# Altium schematic sheet Auxiliary Power.SchDoc
size A4
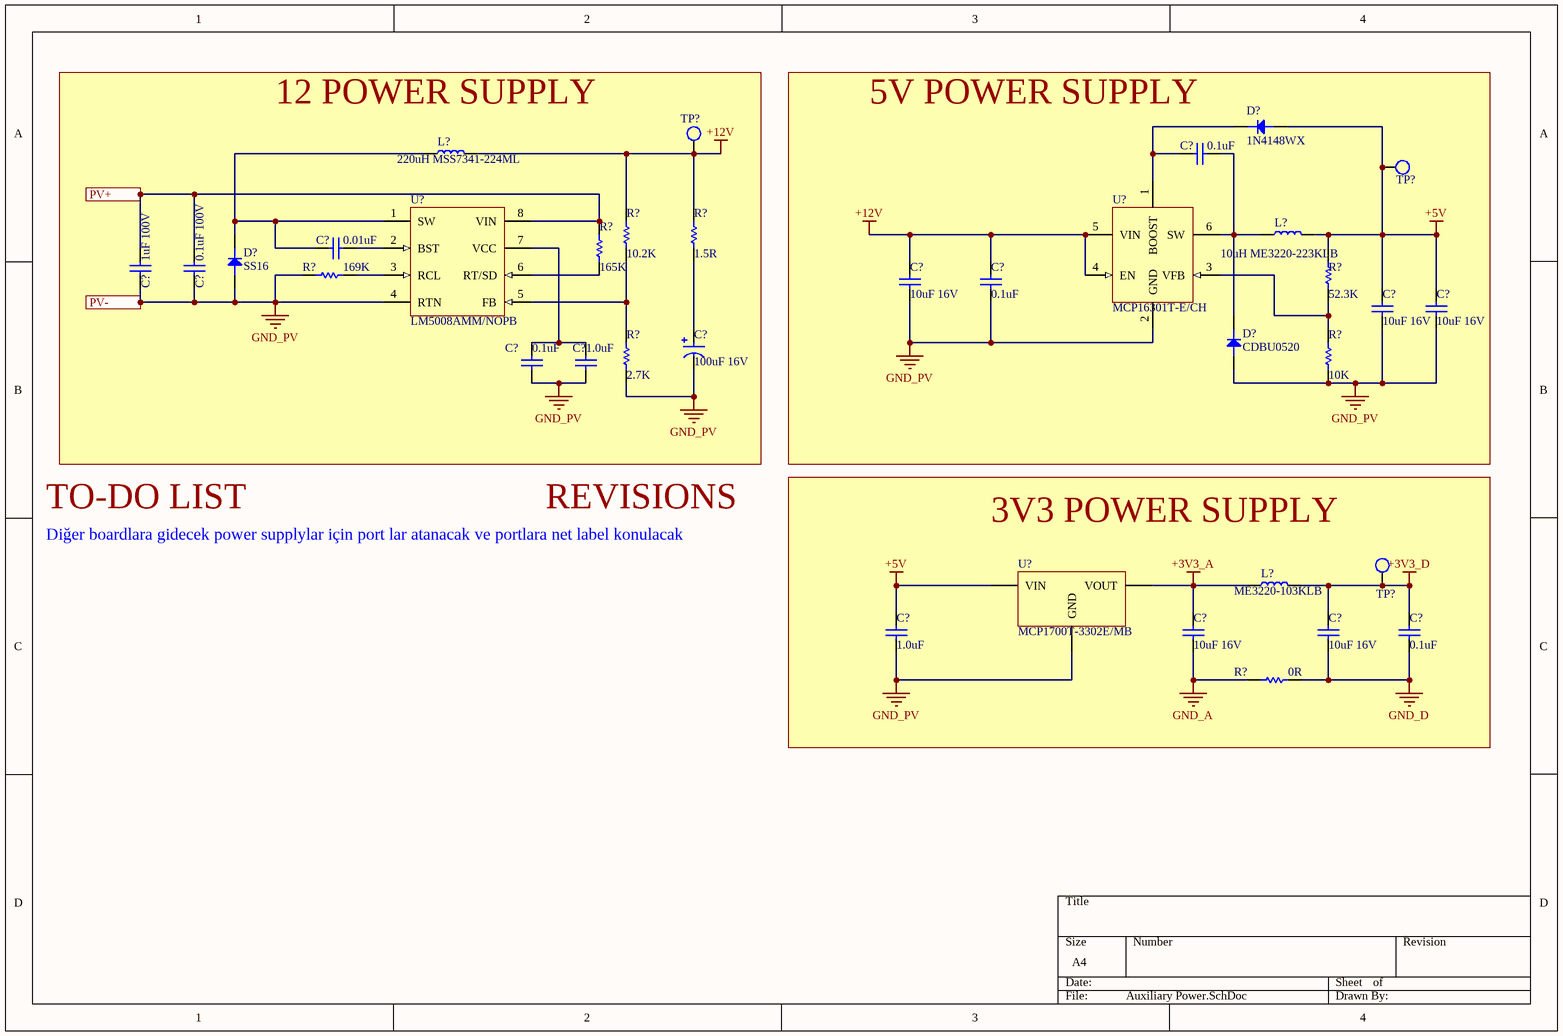
[diagram p0: Auxiliary Power.SchDoc]

## Parts
(Parts that share a designator on the sheet are numbered #1, #2 ... from top to bottom, then left to right.)
C?#1  0.1uF  [1206 CAPACITOR]
C?#2  0.01uF  [1206 CAPACITOR]
C?#3  1uF 100V  [1206 CAPACITOR]
C?#4  0.1uF 100V  [1206 CAPACITOR]
C?#5  10uF 16V  [1206 CAPACITOR]
C?#6  0.1uF  [1206 CAPACITOR]
C?#7  10uF 16V  [1206 CAPACITOR]
C?#8  10uF 16V  [1206 CAPACITOR]
C?#9  100uF 16V  [1206 CAPACITOR]
C?#10  0.1uF  [1206 CAPACITOR]
C?#11  1.0uF  [1206 CAPACITOR]
C?#12  1.0uF  [1206 CAPACITOR]
C?#13  10uF 16V  [1206 CAPACITOR]
C?#14  10uF 16V  [1206 CAPACITOR]
C?#15  0.1uF  [1206 CAPACITOR]
D?#1  1N4148WX  [SOD-323]
D?#2  SS16  [DO-214AC-SMA]
D?#3  CDBU0520  [SOT-523F]
L?#1  220uH MSS7341-224ML  [Inductor MSS7341-224ML]
L?#2  10uH ME3220-223KLB  [Inductor MEE3220-223KLB]
L?#3  ME3220-103KLB  [Inductor MEE3220-223KLB]
R?#1  10.2K  [1206 Resistor Footprint]
R?#2  1.5R  [1206 Resistor Footprint]
R?#3  165K  [1206 Resistor Footprint]
R?#4  169K  [1206 Resistor Footprint]
R?#5  52.3K  [1206 Resistor Footprint]
R?#6  2.7K  [1206 Resistor Footprint]
R?#7  10K  [1206 Resistor Footprint]
R?#8  0R  [1206 Resistor Footprint]
TP?#1  Test Point  [Test Point]  (value not drawn)
TP?#2  Test Point  [Test Point]  (value not drawn)
TP?#3  Test Point  [Test Point]  (value not drawn)
U?#1  LM5008AMM/NOPB  [TSOP 8-LEADS]
U?#2  MCP16301T-E/CH  [SOT-23-6]
U?#3  MCP1700T-3302E/MB  [SOT23-3]

## Blocks framed on the sheet
12 POWER SUPPLY: C?#2-C?#4 C?#9-C?#11 D?#2 L?#1 R?#1-R?#4 R?#6 TP?#1 U?#1
5V POWER SUPPLY: C?#1 C?#5-C?#8 D?#1 D?#3 L?#2 R?#5 R?#7 TP?#2 U?#2
3V3 POWER SUPPLY: C?#12-C?#15 L?#3 R?#8 TP?#3 U?#3

## Ports
PV+, PV-

## Nets
+3V3_A: C?#13.2 L?#3.1 U?#3.3(VOUT)
+3V3_D: C?#14.2 C?#15.2 L?#3.2 TP?#3.1
+5V: C?#7.2 C?#8.2 C?#12.2 D?#1.A L?#2.2 R?#5.2 TP?#2.1 U?#3.2(VIN)
+12V: C?#5.2 C?#6.2 L?#1.2 R?#1.2 R?#2.2 TP?#1.1 U?#2.4(EN) U?#2.5(VIN)
GND_A: C?#13.1 R?#8.2
GND_D: C?#14.1 C?#15.1 R?#8.1
GND_PV: C?#3.1 C?#4.1 C?#5.1 C?#6.1 C?#7.1 C?#8.1 C?#9.1 C?#10.1 C?#11.1 C?#12.1 D?#2.A D?#3.A R?#4.1 R?#6.1 R?#7.1 U?#1.4(RTN) U?#2.2(GND) U?#3.1(GND) ; port PV-
PV+: C?#3.2 C?#4.2 R?#3.2 U?#1.8(VIN) ; port PV+
NetC?#1_1: C?#1.1 D?#1.K U?#2.1(BOOST)
NetC?#1_2: C?#1.2 D?#3.K L?#2.1 U?#2.6(SW)
NetC?#2_1: C?#2.1 D?#2.K L?#1.1 U?#1.1(SW)
NetC?#2_2: C?#2.2 U?#1.2(BST)
NetC?#9_2: C?#9.2 R?#2.1
NetC?#10_2: C?#10.2 C?#11.2 U?#1.7(VCC)
NetR?#1_1: R?#1.1 R?#6.2 U?#1.5(FB)
NetR?#3_1: R?#3.1 U?#1.6(RT/SD)
NetR?#4_2: R?#4.2 U?#1.3(RCL)
NetR?#5_1: R?#5.1 R?#7.2 U?#2.3(VFB)

## Notes on the sheet
- TO-DO LIST
- REVISIONS
- Diğer boardlara gidecek power supplylar için port lar atanacak ve portlara net label konulacak

## Library data of the parts
C?#1-C?#4 C?#6 C?#10-C?#12 C?#15 = Capacitor Non-Polorized: Value: 10uF; Case-EIA: 1206; Tolerance: -20% to +80%; Rated Voltage: 25 V; Case-Metric: 3216; Max Thickness: 1.9 mm; Technology: SMT
C?#5 C?#7 C?#8 C?#13 C?#14 = Capacitor Non-Polorized: Case-EIA: 1206; Tolerance: -20% to +80%; Rated Voltage: 25 V; Case-Metric: 3216; Value: 10uF; Max Thickness: 1.9 mm; Technology: SMT
C?#9 = Capacitor Polorized: Value: 10uF; Case-EIA: 1206; Tolerance: -20% to +80%; Rated Voltage: 25 V; Case-Metric: 3216; Max Thickness: 1.9 mm; Technology: SMT
D?#1-D?#3 = Diode
L?#1-L?#3 = Inductor
R?#1-R?#8 = Resistor
U?#1 = LM5008AMM: 100V, 350 mA Constant On-Time Buck Switching Regulator, 8-pin MSOP, Pb-Free; Manufacturer: Texas Instruments; CompType: Switcher; PackageTopMarking: ZXTT*SAYA; PowerWise: N; Code_JEDEC: MO-187-AA; ComponentLink1Description: Datasheet URL; RoHS: Y; PinCount: 8; PackageReference: DGK0008A; PackageDescription: MINI SOIC, .118 x .118 x .034in, 8 Lead, .0256in Pitch; ComponentLink1URL: http://www.ti.com/general/docs/lit/getliterature.tsp?genericPartNumber=LM5008A&fileType=pdf
U?#2 = MCP16301T-E/CH: High-Voltage Input Integrated Switch Step-Down Regulator, 600 mA, Input Voltage 4.0 to 30 V, Output Voltage 2.0 to 15 V, -40 to 125 degC, 6-pin SOT-23 (CH6), Tape and Reel; Manufacturer: Microchip; ComponentLink3Description: Package Specification; PackageDescription: 6-Lead Plastic Small Outline Transistor, 2.9 x 1.55 mm Body, 0.95 mm Pitch; PackageReference: SOT-23-CH6; ComponentLink4Description: Product URL; ComponentLink1URL: http://www.microchip.com; ComponentLink4URL: http://www.microchip.com/MCP16301; ComponentLink2Description: Datasheet; Mounting Technology: Surface Mount; DatasheetVersion: Rev. B; ComponentLink1Description: Manufacturer URL; PartNumber: MCP16301T-E/CH; ComponentLink2URL: http://ww1.microchip.com/downloads/en/DeviceDoc/25004B.pdf; ComponentLink3URL: http://www.microchip.com/stellent/groups/techpub_sg/documents/packagingspec/en012702.pdf; PackageVersion: C04-028B
U?#3 = MCP1700T-3302E/MB: MICROCHIP - MCP1700T-3302E/MB - V REG, LDO, 0.25A, SMD, SOT-89-8; Supplier 1: Avnet; Manufacturer: Microchip; Manufacturer Part Number: MCP1700T-3302E/MB; RoHS: Yes; Category: Voltage Regulators - Linear; Stock 1: 7000; Pricing 1: 1000=0.30000, 2000=0.29520, 4000=0.28800, 6000=0.28320, 8000=0.27840 (USD); ComponentLink1URL: https://datasheet.ciiva.com/2040/21826b-2040133.pdf?src-supplier=Digi-Key; ComponentLink1Description: https://datasheet.ciiva.com/2040/21826b-2040133.pdf?src-supplier=Digi-Key; ComponentLink2URL: https://datasheet.ciiva.com/8239/21826b-8239141.pdf?src-supplier=Avnet; ComponentLink2Description: https://datasheet.ciiva.com/8239/21826b-8239141.pdf?src-supplier=Avnet; ComponentLink3URL: https://datasheet.ciiva.com/2040/21826b-2040134.pdf?src-supplier=Digi-Key; ComponentLink3Description: https://datasheet.ciiva.com/2040/21826b-2040134.pdf?src-supplier=Digi-Key; ComponentLink4URL: https://datasheet.ciiva.com/46425/21826b-46425574.pdf?src-supplier=Element14; ComponentLink4Description: https://datasheet.ciiva.com/46425/21826b-46425574.pdf?src-supplier=Element14; ComponentLink5URL: https://datasheet.ciiva.com/2040/21826b-2040135.pdf?src-supplier=Digi-Key; ComponentLink5Description: https://datasheet.ciiva.com/2040/21826b-2040135.pdf?src-supplier=Digi-Key; ComponentLink6URL: https://datasheet.ciiva.com/14150/mcp1700-eng-tds-14150121.pdf?src-supplier=Distrelec; ComponentLink6Description: https://datasheet.ciiva.com/14150/mcp1700-eng-tds-14150121.pdf?src-supplier=Distrelec; ComponentLink7URL: https://datasheet.ciiva.com/22710/77612-22710987.pdf?src-supplier=Element14; ComponentLink7Description: https://datasheet.ciiva.com/22710/77612-22710987.pdf?src-supplier=Element14; ComponentLink8URL: https://datasheet.ciiva.com/16372/filehandler-aspxddocname-en011779-16372940.pdf?src-supplier=Future+Electronics; ComponentLink8Description: https://datasheet.ciiva.com/16372/filehandler-aspxddocname-en011779-16372940.pdf?src-supplier=Future+Electronics; Supplier Part Number 1: MCP1700T-3302E/MB